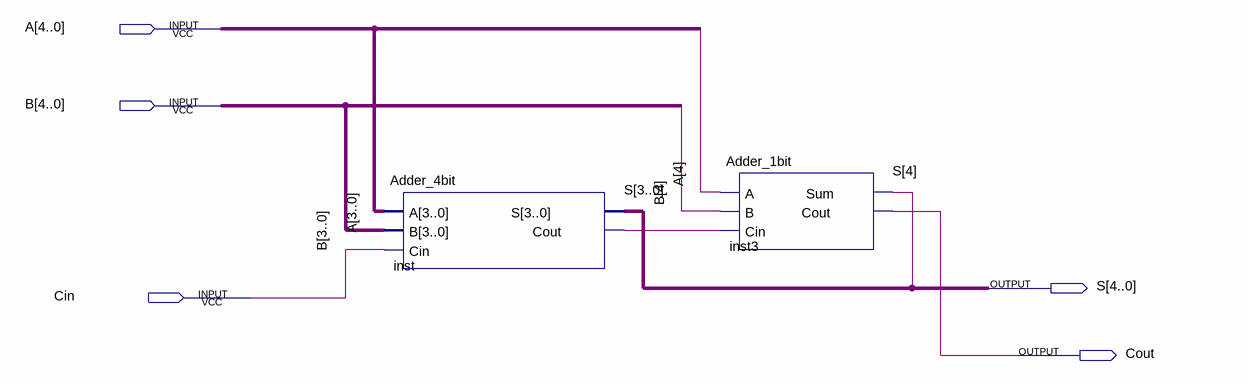
[diagram p0: schematic sheet]
// Quartus schematic Adder_5bit.bdf as structural Verilog: 2 symbols, 5 pins
module Adder_5bit (
  input  [4:0] A,
  input  [4:0] B,
  input  Cin,
  output [4:0] S,
  output Cout
);

  wire inst_cout;

  Adder_4bit inst (.A(A[3:0]), .B(B[3:0]), .Cin(Cin), .S(S[3:0]), .Cout(inst_cout));
  Adder_1bit inst3 (.A(A[4]), .B(B[4]), .Cin(inst_cout), .Sum(S[4]), .Cout(Cout));
endmodule
